# EAGLE design OLED-PicoW_V0 (EAGLE 9.6.2)
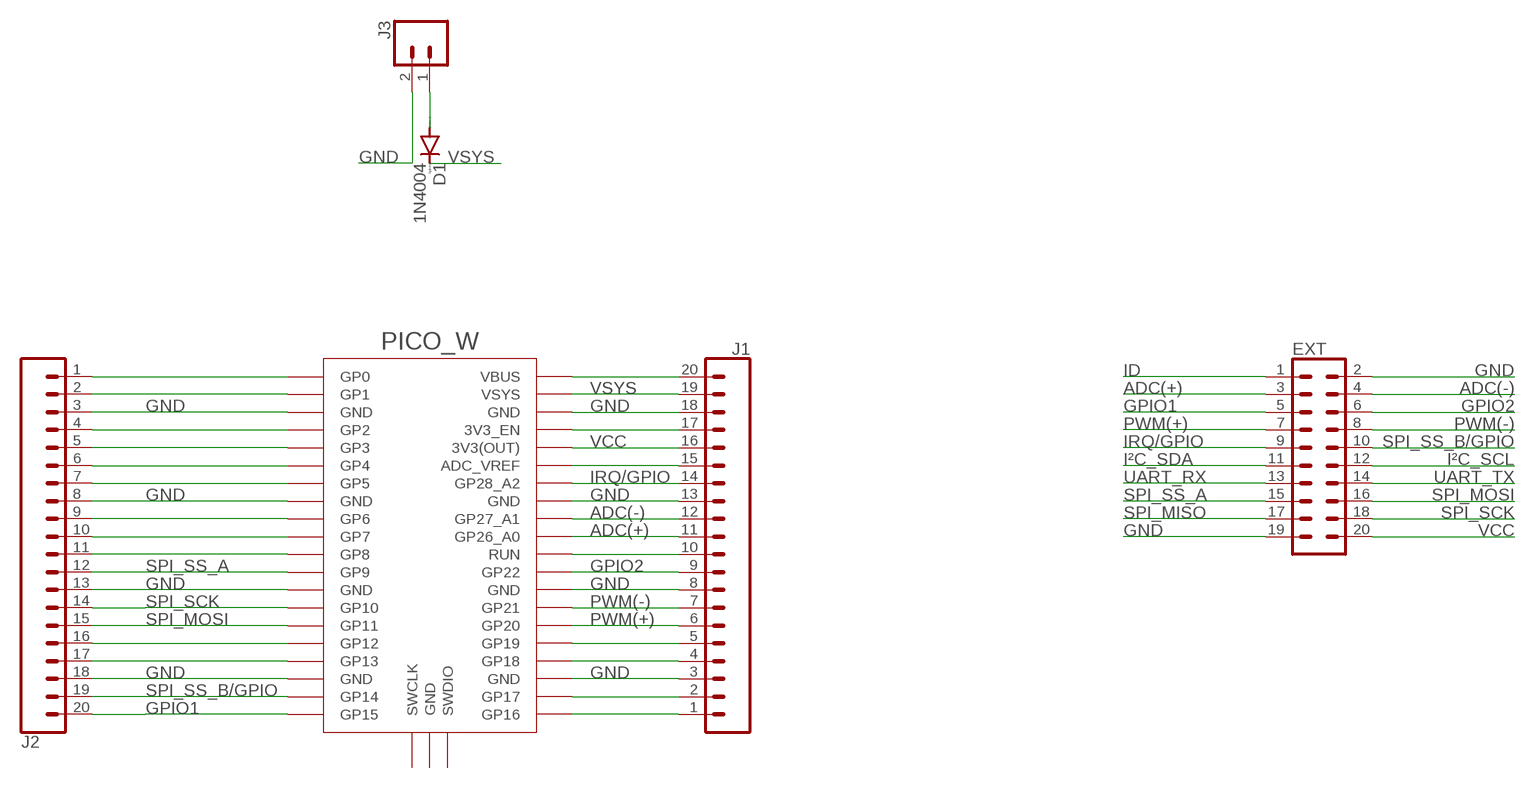
[diagram p0: schematic, sheet 1]

## Parts
D1  1N4004  [DO41-10]
EXT  CONN_10X2  [2X10]
J1  CONN_20  [1X20]
J2  CONN_20  [1X20]
J3  CONN_023.5MM  [SCREWTERMINAL-3.5MM-2]
PICO_W  RPI_PICO_IG-TH  [RPI_PICO_TH]

## Nets
ADC(+): EXT.3 J1.11 PICO_W.GP26_A0
ADC(-): EXT.4 J1.12 PICO_W.GP27_A1
GND: EXT.2 EXT.19 J1.3 J1.8 J1.13 J1.18 J2.3 J2.8 J2.13 J2.18 J3.2 PICO_W.AGND(GND) PICO_W.GND@1(GND) PICO_W.GND@2(GND) PICO_W.GND@3(GND) PICO_W.GND@4(GND) PICO_W.GND@6(GND) PICO_W.GND@7(GND) PICO_W.GND@8(GND)
GPIO1: EXT.5 J2.20 PICO_W.GP15
GPIO2: EXT.6 J1.9 PICO_W.GP22
ID: EXT.1
IRQ/GPIO: EXT.9 J1.14 PICO_W.GP28_A2
I²C_SCL: EXT.12
I²C_SDA: EXT.11
N$1: J1.20 PICO_W.VBUS
N$2: J1.5 PICO_W.GP19
N$3: J1.17 PICO_W.3V3_EN
N$4: J1.15 PICO_W.ADC_VREF
N$5: J1.4 PICO_W.GP18
N$9: J1.10 PICO_W.RUN
N$15: J1.2 PICO_W.GP17
N$16: J1.1 PICO_W.GP16
N$17: J2.1 PICO_W.GP0
N$18: J2.2 PICO_W.GP1
N$19: J2.4 PICO_W.GP2
N$20: J2.5 PICO_W.GP3
N$21: J2.6 PICO_W.GP4
N$22: J2.7 PICO_W.GP5
N$23: J2.9 PICO_W.GP6
N$24: J2.10 PICO_W.GP7
N$25: J2.11 PICO_W.GP8
N$26: J2.16 PICO_W.GP12
N$27: J2.17 PICO_W.GP13
N$28: D1.A J3.1
PWM(+): EXT.7 J1.6 PICO_W.GP20
PWM(-): EXT.8 J1.7 PICO_W.GP21
SPI_MISO: EXT.17
SPI_MOSI: EXT.16 J2.15 PICO_W.GP11
SPI_SCK: EXT.18 J2.14 PICO_W.GP10
SPI_SS_A: EXT.15 J2.12 PICO_W.GP9
SPI_SS_B/GPIO: EXT.10 J2.19 PICO_W.GP14
UART_RX: EXT.13
UART_TX: EXT.14
VCC: EXT.20 J1.16 PICO_W.3V3(OUT)
VSYS: D1.C J1.19 PICO_W.VSYS
Unconnected: PICO_W.GND@5(GND) PICO_W.SWCLK PICO_W.SWDIO

## Library data of the parts
D1 = diode:1N4004: DIODE general purpose rectifier, 1 A
EXT = SparkFun-Connectors:CONN_10X2: Multi connection point. Often used as Generic Header-pin footprint for 0.1 inch spaced/style header connections On any of the 0.1 inch spaced packages, you can populate with these: Break Away Headers - Straight <https://www.sparkfun.com/products/116> (PRT-00116) Break Away Male Headers - Right Angle <https://www.sparkfun.com/products/553> (PRT-00553) Female Headers <https://www.sparkfun.com/products/115> (PRT-00115) Break Away Headers - Machine Pin <https://www.sparkfun.com/products/117> (PRT-00117) Break Away Female Headers - Swiss Machine Pin <https://www.sparkfun.com/products/743> (PRT-00743) Special note about the "SPECIAL" package: This was SPECIALLY designed to be used with our Graphic LCD Backpack. Be sure you want to use this! It is not only staggered on each line of header holes, but IT IS ALSO offset of the center point of the top and bottom lines by 5 mil. This causes the headers to lock into place on the "standard" footprint on the LCD screen. The extra squares on the tdocu layer are there simply to reference other pins (if you were to actually populate a longer header than ten long - this is what we do with the backpacks).
J1 J2 = SparkFun-Connectors:CONN_20: Multi connection point. Often used as Generic Header-pin footprint for 0.1 inch spaced/style header connections On any of the 0.1 inch spaced packages, you can populate with these: Break Away Headers - Straight <https://www.sparkfun.com/products/116> (PRT-00116) Break Away Male Headers - Right Angle <https://www.sparkfun.com/products/553> (PRT-00553) Female Headers <https://www.sparkfun.com/products/115> (PRT-00115) Break Away Headers - Machine Pin <https://www.sparkfun.com/products/117> (PRT-00117) Break Away Female Headers - Swiss Machine Pin <https://www.sparkfun.com/products/743> (PRT-00743) For SCREWTERMINALS and SPRING TERMINALS visit here: Screw Terimnals on SparkFun.com <https://www.sparkfun.com/search/results?term=Screw+Terminals> (5mm/3.5mm/2.54mm spacing) This device is also useful as a general connection point to wire up your design to another part of your project. Our various solder wires solder well into these plated through hole pads. Hook-Up Wire - Assortment (Stranded, 22 AWG) <https://www.sparkfun.com/products/11375> (PRT-11375) Hook-Up Wire - Assortment (Solid Core, 22 AWG) <https://www.sparkfun.com/products/11367> (PRT-11367) View the entire wire category on our website here <https://www.sparkfun.com/categories/141> Special notes: Molex polarized connector foot print use with SKU : PRT-08231 with associated crimp pins and housings. 1MM SMD Version SKU: PRT-10208 NOTES ON THE VARIANTS LOCK and LOCK_LONGPADS... This footprint was designed to help hold the alignment of a through-hole component (i.e. 6-pin header) while soldering it into place. You may notice that each hole has been shifted either up or down by 0.005 of an inch from it's more standard position (which is a perfectly straight line). This slight alteration caused the pins (the squares in the middle) to touch the edges of the holes. Because they are alternating, it causes a "brace" to hold the component in place. 0.005 has proven to be the perfect amount of "off-center" position when using our standard breakaway headers. Although looks a little odd when you look at the bare footprint, once you have a header in there, the alteration is very hard to notice. Also,if you push a header all the way into place, it is covered up entirely on the bottom side. Note about LOCK SPECIAL package: This is just like the LOCK variant in that the holes are staggared by 5 mil, but except for the last two holes. They are not altered from the "standard" footprint layout. This is used for a special purpose on the layout of our Graphic LCD Backpack. Make sure you want to use this device before selecting it for you project!
J3 = SparkFun-Connectors:CONN_02: Multi connection point. Often used as Generic Header-pin footprint for 0.1 inch spaced/style header connections On any of the 0.1 inch spaced packages, you can populate with these: Break Away Headers - Straight <https://www.sparkfun.com/products/116> (PRT-00116) Break Away Male Headers - Right Angle <https://www.sparkfun.com/products/553> (PRT-00553) Female Headers <https://www.sparkfun.com/products/115> (PRT-00115) Break Away Headers - Machine Pin <https://www.sparkfun.com/products/117> (PRT-00117) Break Away Female Headers - Swiss Machine Pin <https://www.sparkfun.com/products/743> (PRT-00743) For SCREWTERMINALS and SPRING TERMINALS visit here: Screw Terimnals on SparkFun.com <https://www.sparkfun.com/search/results?term=Screw+Terminals> (5mm/3.5mm/2.54mm spacing) This device is also useful as a general connection point to wire up your design to another part of your project. Our various solder wires solder well into these plated through hole pads. Hook-Up Wire - Assortment (Stranded, 22 AWG) <https://www.sparkfun.com/products/11375> (PRT-11375) Hook-Up Wire - Assortment (Solid Core, 22 AWG) <https://www.sparkfun.com/products/11367> (PRT-11367) View the entire wire category on our website here <https://www.sparkfun.com/categories/141> Special notes: Molex polarized connector foot print use with: PRT-08233 with associated crimp pins and housings. 2.54_SCREWTERM for use with PRT-10571. 3.5mm Screw Terminal footprints for PRT-08084 5mm Screw Terminal footprints for use with PRT-08432; PROD_ID: CONN-08399
PICO_W = RaspberryPi_PicoW:RPI_PICO_IG

## Net classes
0 default: width 0.508 mm, drill 0.457 mm, clearance 0.178 mm

## Board
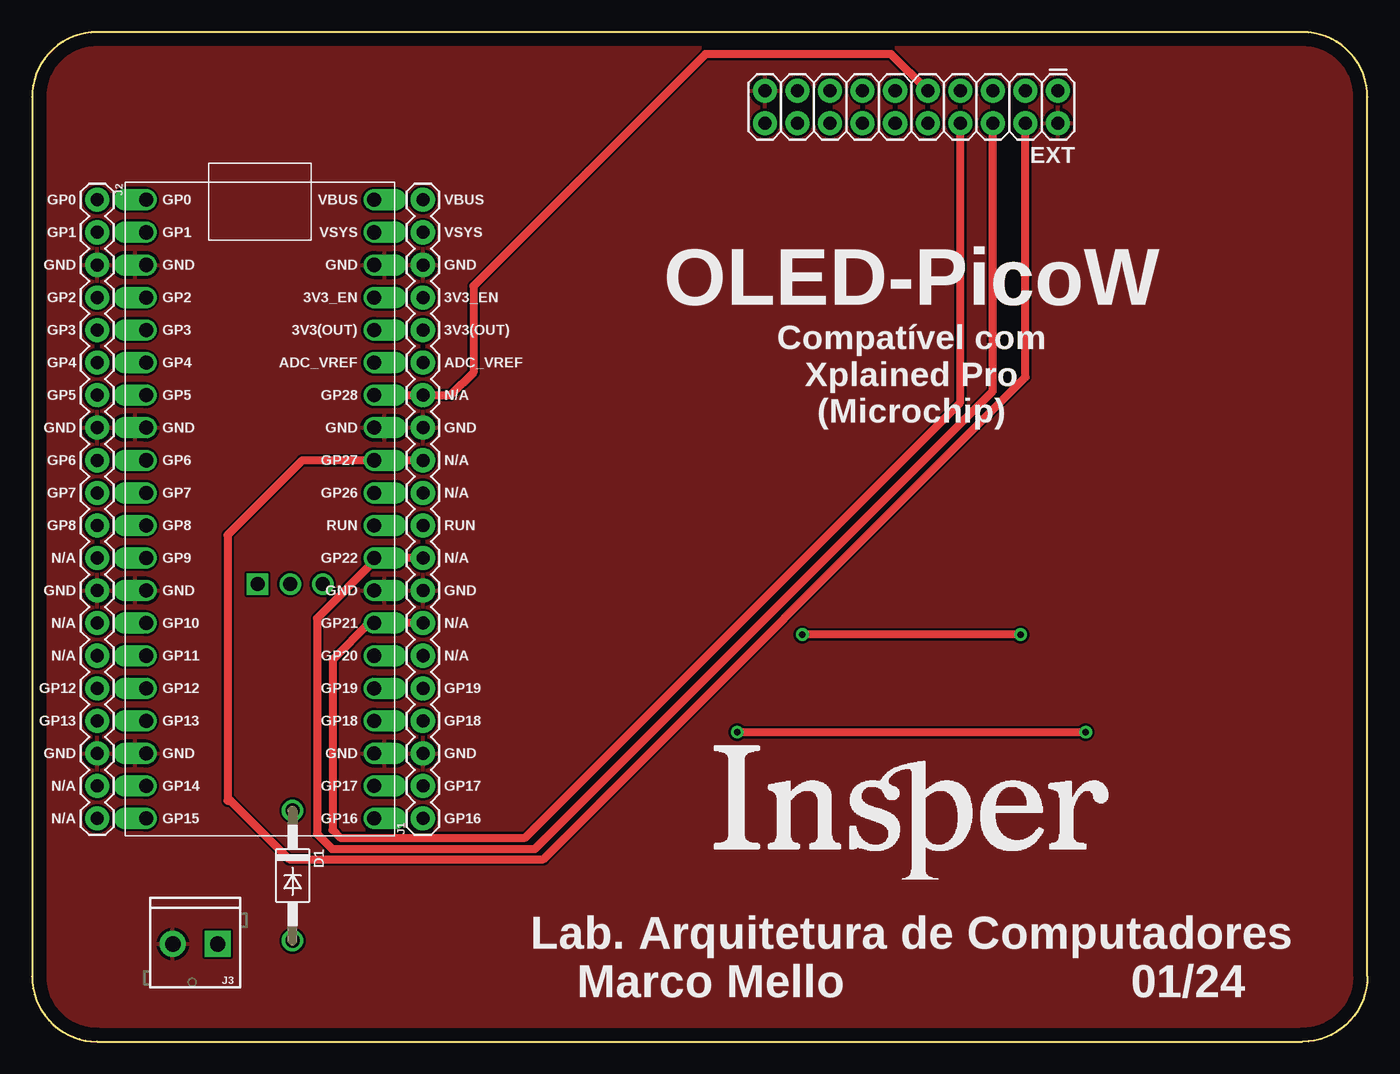
[diagram p1: board, top side]
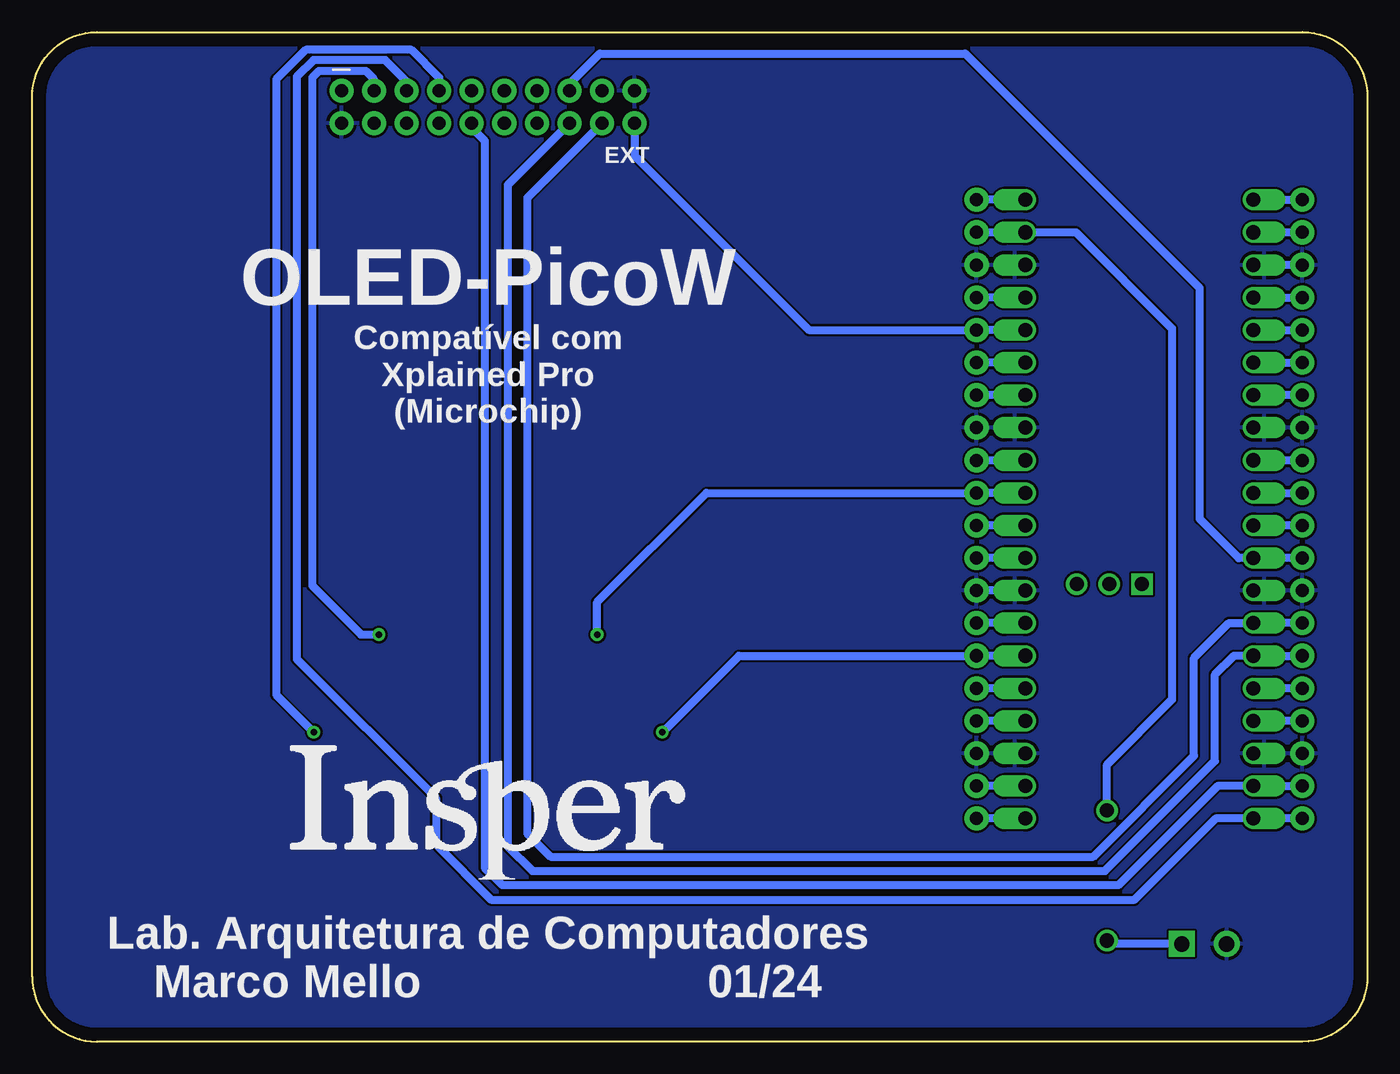
[diagram p2: board, bottom side, seen from below]

Size 104.14 x 78.74 mm. Coordinates in mm from the lower left corner, seen from the top.
Outline: 5.08,0 99.06,0 arc90 104.14,5.08 104.14,73.66 arc90 99.06,78.74 5.08,78.74 arc90 0,73.66 0,5.08
Outline: 0,5.08 arc90 5.08,0
Outline: 0,5.08 arc90 5.08,0
Copper layers (1*16): Top 0.035mm / dielectric 1.5mm / Bottom 0.035mm
Design rules "default *": minimum track width 6mil, minimum drill 0.35mm, track to track 4mil, track to pad 4mil, pad to pad 4mil, via to via 4mil, smd to smd 4mil, copper to edge 40mil, drill to drill 6mil, minimum pad ring 10mil, minimum via ring 8mil, stop-mask expansion 4mil, vias tented up to drill 0mil, thermal gap 10mil

### Footprints (pad centres in the part's own frame; a part is rotated, then mirrored left to right if it is on the bottom)
DO41-10 = drill 1.118: A 5.08,0; C -5.08,0
2X10 = drill 1.016 pad 1.88: 1 0,0; 2 0,2.54; 3 2.54,0; 4 2.54,2.54; 5 5.08,0; 6 5.08,2.54; 7 7.62,0; 8 7.62,2.54; 9 10.16,0; 10 10.16,2.54; 11 12.7,0; 12 12.7,2.54; 13 15.24,0; 14 15.24,2.54; 15 17.78,0; 16 17.78,2.54; 17 20.32,0; 18 20.32,2.54; 19 22.86,0; 20 22.86,2.54
1X20 = drill 1.016 pad 1.88: 1 0,0; 2 2.54,0; 3 5.08,0; 4 7.62,0; 5 10.16,0; 6 12.7,0; 7 15.24,0; 8 17.78,0; 9 20.32,0; 10 22.86,0; 11 25.4,0; 12 27.94,0; 13 30.48,0; 14 33.02,0; 15 35.56,0; 16 38.1,0; 17 40.64,0; 18 43.18,0; 19 45.72,0; 20 48.26,0
SCREWTERMINAL-3.5MM-2 = drill 1.2 pad 2.032 square: 1 0,0 | drill 1.2 pad 2.032: 2 3.5,0
RPI_PICO_TH = drill 1.1 pad 1.676 offset: 3V3(OUT) 8.89,13.97; 3V3_EN 8.89,16.51; ADC_VREF 8.89,11.43; AGND 8.89,6.35; GND@1 -8.89,19.05; GND@2 -8.89,6.35; GND@3 -8.89,-6.35; GND@4 -8.89,-19.05; GND@6 8.89,-19.05; GND@7 8.89,-6.35; GND@8 8.89,19.05; GP0 -8.89,24.13; GP1 -8.89,21.59; GP2 -8.89,16.51; GP3 -8.89,13.97; GP4 -8.89,11.43; GP5 -8.89,8.89; GP6 -8.89,3.81; GP7 -8.89,1.27; GP8 -8.89,-1.27; GP9 -8.89,-3.81; GP10 -8.89,-8.89; GP11 -8.89,-11.43; GP12 -8.89,-13.97; GP13 -8.89,-16.51; GP14 -8.89,-21.59; GP15 -8.89,-24.13; GP16 8.89,-24.13; GP17 8.89,-21.59; GP18 8.89,-16.51; GP19 8.89,-13.97; GP20 8.89,-11.43; GP21 8.89,-8.89; GP22 8.89,-3.81; GP26_A0 8.89,1.27; GP27_A1 8.89,3.81; GP28_A2 8.89,8.89; RUN 8.89,-1.27; VBUS 8.89,24.13; VSYS 8.89,21.59 | drill 1.1 pad 1.676: GND@5 2.35,-5.85; SWDIO 4.89,-5.85 | drill 1.1 pad 1.676 square: SWCLK -0.19,-5.85

### Placement (x,y rotation side)
D1  20.32,12.95 270 top
EXT  80.01,74.17 180 top
J1  30.48,17.4 90 top
J2  5.08,65.66 270 top
J3  14.48,7.62 180 top
PICO_W  17.78,41.53 0 top

### Tracks (layer width: path | path; a pad name or v marks a point on that pad's centre or on a via)
ADC(+)  (via drill 0.5 pad 1)
  Top 0.61: v77.09,31.75 v60.07,31.75
  Bottom 0.61: PICO_W.GP26_A0 J1.11 51.56,42.8 60.07,34.29 v60.07,31.75 | EXT.3 77.47,75.06 78.11,75.69 81.79,75.69 82.3,75.18 82.3,35.56 78.49,31.75 v77.09,31.75
ADC(-)
  Top 0.61: J1.12 21.08,45.34 15.24,39.5 15.24,18.8 15.49,18.8 20.07,14.22 39.88,14.22 77.47,51.82 EXT.4
  Bottom 0.61: PICO_W.GP27_A1 J1.12
GND
  Bottom 0.61: J2.3 PICO_W.GND@1 | PICO_W.GND@7 J1.8
  pour Bottom: 0,0 104.14,0 104.14,78.74 0,78.74
  pour Top: 0,0 104.14,0 104.14,78.74 0,78.74
GPIO1
  Bottom 0.61: EXT.5 74.93,74.88 76.61,76.56 82.19,76.56 83.49,75.26 83.49,29.84 72.64,19 72.64,15.37 68.35,11.07 18.16,11.07 11.84,17.4 PICO_W.GP15 J2.20
GPIO2
  Top 0.61: EXT.6 74.93,50.74 39.21,15.02 23.4,15.02 22.23,16.19 22.23,33.02 26.92,37.72 J1.9
  Bottom 0.61: PICO_W.GP22 J1.9
IRQ/GPIO
  Top 0.61: EXT.9 66.99,77.03 52.51,77.03 34.42,58.93 34.42,52.2 32.64,50.42 PICO_W.GP28_A2
  Bottom 0.61: PICO_W.GP28_A2 J1.14
N$1
  Bottom 0.61: PICO_W.VBUS J1.20
N$2
  Bottom 0.61: PICO_W.GP19 J1.5
N$3
  Bottom 0.61: PICO_W.3V3_EN J1.17
N$4
  Bottom 0.61: PICO_W.ADC_VREF J1.15
N$5
  Bottom 0.61: PICO_W.GP18 J1.4
N$9
  Bottom 0.61: PICO_W.RUN J1.10
N$15
  Bottom 0.61: PICO_W.GP17 J1.2
N$16
  Bottom 0.61: PICO_W.GP16 J1.1
N$17
  Bottom 0.61: PICO_W.GP0 J2.1
N$18
  Bottom 0.61: PICO_W.GP1 J2.2
N$19
  Bottom 0.61: PICO_W.GP2 J2.4
N$20
  Bottom 0.61: PICO_W.GP3 J2.5
N$21
  Bottom 0.61: PICO_W.GP4 J2.6
N$22
  Bottom 0.61: J2.7 PICO_W.GP5
N$23
  Bottom 0.61: J2.9 PICO_W.GP6
N$24
  Bottom 0.61: PICO_W.GP7 J2.10
N$25
  Bottom 0.61: J2.11 PICO_W.GP8
N$26
  Bottom 0.61: J2.16 PICO_W.GP12
N$27
  Bottom 0.61: J2.17 PICO_W.GP13
N$28
  Bottom 0.61: J3.1 20.07,7.62 D1.A
PWM(+)  (via drill 0.5 pad 1)
  Top 0.61: v82.17,24.13 v54.99,24.13
  Bottom 0.61: PICO_W.GP20 J1.6 49.02,30.1 v54.99,24.13 | EXT.7 72.39,75.18 74.55,77.34 82.8,77.34 85.09,75.06 85.09,27.05 v82.17,24.13
PWM(-)
  Top 0.61: EXT.8 72.39,49.85 38.45,15.91 24.04,15.91 23.43,16.51 23.43,29.78 26.29,32.64 J1.7
  Bottom 0.61: PICO_W.GP21 J1.7
SPI_MOSI
  Bottom 0.61: J2.15 PICO_W.GP11 10.41,30.1 11.89,28.63 11.89,21.89 20.47,13.31 65.13,13.31 67.06,15.24 67.06,66.8 EXT.16
SPI_SCK
  Bottom 0.61: J2.14 PICO_W.GP10 10.79,32.64 13.53,29.91 13.53,22.29 21.39,14.43 63.7,14.43 65.53,16.26 65.53,65.79 EXT.18
SPI_SS_A
  Bottom 0.61: EXT.15 62.23,74.7 59.87,77.06 31.37,77.06 13.08,58.78 13.08,40.77 10.03,37.72 PICO_W.GP9 J2.12
SPI_SS_B/GPIO
  Bottom 0.61: EXT.10 69.85,71.27 68.83,70.26 68.83,13.56 67.46,12.19 19.43,12.19 11.68,19.94 PICO_W.GP14 J2.19
VCC
  Bottom 0.61: PICO_W.3V3(OUT) J1.16 43.56,55.5 57.15,69.09 EXT.20
VSYS
  Bottom 0.61: J1.19 PICO_W.VSYS 22.73,63.12 15.24,55.63 15.24,26.67 20.32,21.59 D1.C

### Text on the board
tPlace: EXT | GP0 | VBUS | GP1 | VSYS | GND | GND | OLED-PicoW | GP2 | 3V3_EN | GP3 | 3V3(OUT) | GP4 | ADC_VREF | Compatível com / Xplained Pro / (Microchip) | GP5 | N/A | GND | GND | GP6 | N/A | GP7 | N/A | GP8 | RUN | N/A | N/A | GND | GND | N/A | N/A | N/A | N/A | GP12 | GP19 | GP13 | GP18 | GND | GND | N/A | GP17 | N/A | GP16 | Lab. Arquitetura de Computadores / Marco Mello 01/24
bPlace: EXT | OLED-PicoW | Compatível com / Xplained Pro / (Microchip) | Lab. Arquitetura de Computadores / Marco Mello 01/24